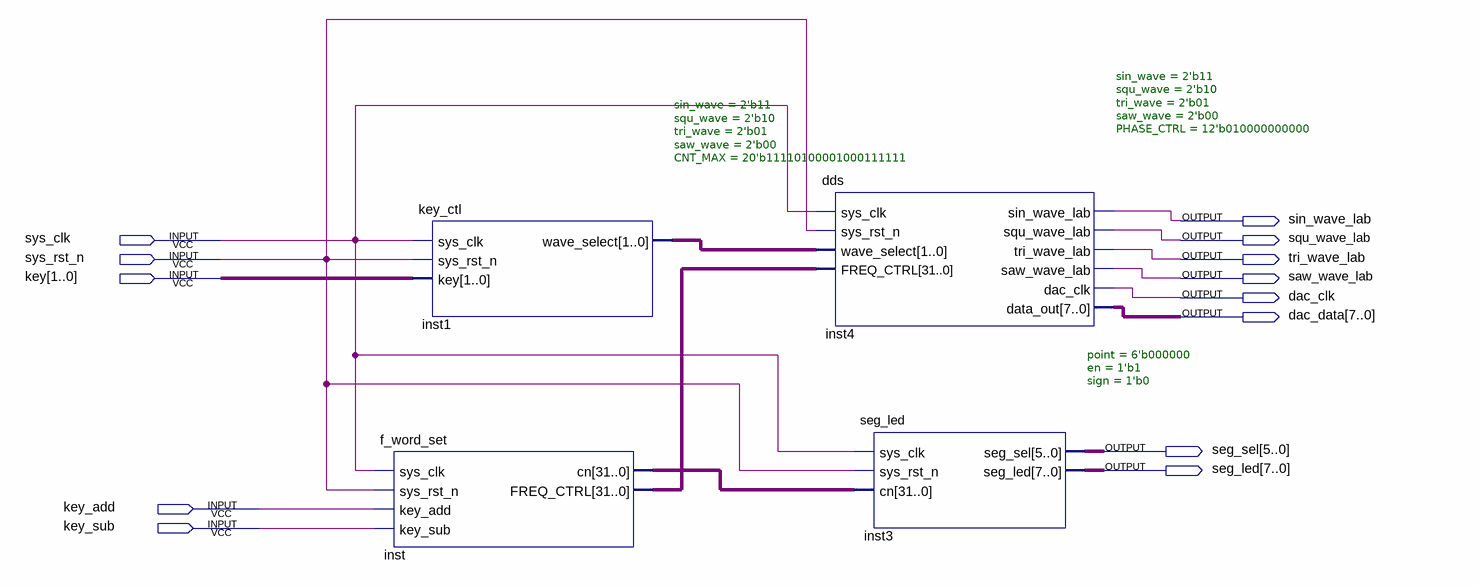
[diagram p0: schematic sheet]
// Quartus schematic view.bdf as structural Verilog: 4 symbols, 13 pins
module view (
  input  sys_clk,
  input  sys_rst_n,
  input  [1:0] key,
  input  key_add,
  input  key_sub,
  output sin_wave_lab,
  output squ_wave_lab,
  output tri_wave_lab,
  output saw_wave_lab,
  output dac_clk,
  output [7:0] dac_data,
  output [5:0] seg_sel,
  output [7:0] seg_led
);

  wire [1:0] inst1_wave_select;
  wire [31:0] inst_cn, inst_freq_ctrl;

  f_word_set inst (
    .sys_clk(sys_clk), .sys_rst_n(sys_rst_n), .key_add(key_add), .key_sub(key_sub), .cn(inst_cn),
    .FREQ_CTRL(inst_freq_ctrl));
  key_ctl #(.sin_wave(2'b11), .squ_wave(2'b10), .tri_wave(2'b01), .saw_wave(2'b00), .CNT_MAX(20'b11110100001000111111)) inst1 (
    .sys_clk(sys_clk), .sys_rst_n(sys_rst_n), .key(key), .wave_select(inst1_wave_select));
  dds #(.sin_wave(2'b11), .squ_wave(2'b10), .tri_wave(2'b01), .saw_wave(2'b00), .PHASE_CTRL(12'b010000000000)) inst4 (
    .sys_clk(sys_clk), .sys_rst_n(sys_rst_n), .wave_select(inst1_wave_select), .FREQ_CTRL(inst_freq_ctrl),
    .sin_wave_lab(sin_wave_lab), .squ_wave_lab(squ_wave_lab), .tri_wave_lab(tri_wave_lab),
    .saw_wave_lab(saw_wave_lab), .dac_clk(dac_clk), .data_out(dac_data));
  seg_led #(.point(6'b000000), .en(1'b1), .sign(1'b0)) inst3 (
    .sys_clk(sys_clk), .sys_rst_n(sys_rst_n), .cn(inst_cn), .seg_sel(seg_sel), .seg_led(seg_led));
endmodule
